# Altium schematic sheet Potentiometers.SchDoc
size A4; SheetNumber: 6; SheetTotal: 6
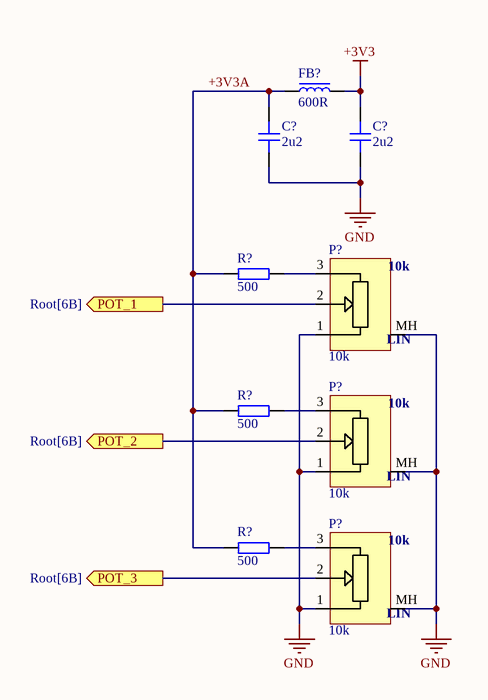
[diagram p0: Potentiometers.SchDoc]

## Parts
(Parts that share a designator on the sheet are numbered #1, #2 ... from top to bottom, then left to right.)
C?#1  2u2  [CAP_0603]
C?#2  2u2  [CAP_0603]
FB?  600R  [FB_0805]
P?#1  10k  [RD901F-40-15R1]
P?#2  10k  [RD901F-40-15R1]
P?#3  10k  [RD901F-40-15R1]
R?#1  500  [RES_0603]
R?#2  500  [RES_0603]
R?#3  500  [RES_0603]

## Ports
POT_1 (out, see Root[6B]), POT_2 (out, see Root[6B]), POT_3 (out, see Root[6B])

## Nets
+3V3: C?#2.2 FB?.2
GND: C?#1.1 C?#2.1 P?#1.1 P?#1.MH P?#2.1 P?#2.MH P?#3.1 P?#3.MH
+3V3A: C?#1.2 FB?.1 R?#1.2 R?#2.2 R?#3.2
POT_1: P?#1.2 ; port POT_1
POT_2: P?#2.2 ; port POT_2
POT_3: P?#3.2 ; port POT_3
NetP?#1_3: P?#1.3 R?#1.1
NetP?#2_3: P?#2.3 R?#2.1
NetP?#3_3: P?#3.3 R?#3.1

## Notes on the sheet
- (in symbol RD901F-40-15R1-B10K) LIN

## Library data of the parts
C?#1 C?#2 = CAP_0603: Capacitor SMD 0603; Manufacturer: *; Manufacturer Part Number: *; Distributor Link: *; LCSC: *; Rating: *; Dielectric: *
FB? = FB_0805: 300mOhm DC, 600R @ 100MHz; Manufacturer: *; Manufacturer Part Number: *; Distributor Link: *; LCSC: *
P?#1-P?#3 = RD901F-40-15R1-B10K: Potentiometer Vertical 10k 20% Linear Taper THT PCB-Mount 6/15mm Shaft Smooth; Manufacturer: Alps Alpine; Manufacturer Part Number: RD901F-40-15R1-B10K; Distributor Link: https://www.mouser.de/ProductDetail/Alpha-Taiwan/RD901F-40-15R1-B10K-00DL1?qs=1mbolxNpo8c1WX5KjxIjjw%3D%3D
R?#1-R?#3 = RES_0603: Resistor SMD 0603; Manufacturer: *; Manufacturer Part Number: *; Distributor Link: *; LCSC: *